# Altium project probe.PrjPcb
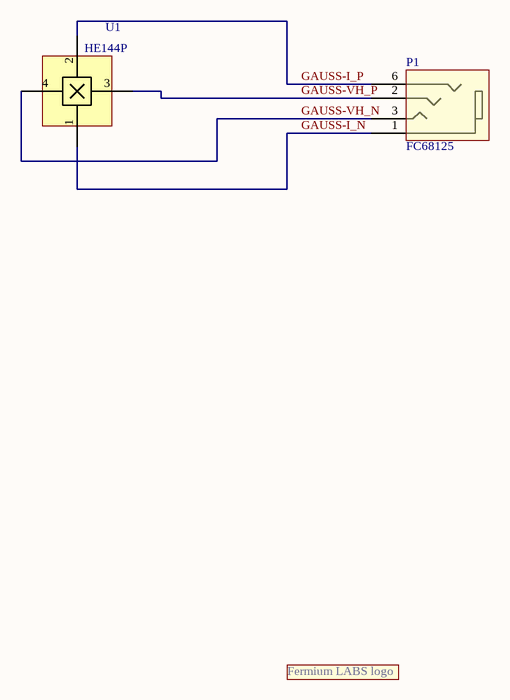
[diagram p0: probe.SchDoc]
1 sheet, 3 parts. Net scope: global (net labels, ports and power ports of the same name join across sheets).
Board file: probe.PcbDoc

## Sheet probe.SchDoc: Hall / Probe board
size A4; DocumentNumber: 1; SheetNumber: 1; SheetTotal: 1

### Parts
logo  fermiumlabs-logo  [frm-med]  (value not drawn)  (no BOM)
P1  (no value)  [FC68125]
U1  (no value)  [HE144P-buried]

### Nets
GAUSS-I_N: P1.1 U1.1
GAUSS-I_P: P1.6 U1.2
GAUSS-VH_N: P1.3 U1.4
GAUSS-VH_P: P1.2 U1.3

### Notes on the sheet
- Title
- Size:
- Date:
- A4
- Number:
- Time:
- Revision:
- Sheet
- of
- Fermium LABS srl
- Via Monselice 15a
- 35142 Padova PD
- Italy
- File:
- (in symbol fermiumlabs-logo) Fermium LABS logo

### Library data of the parts
P1 = FC68125: Manufacturer: CLIFF; Unit: pcs; SuppliedAmount: 0; MinAmount: 2; Multiples: 1; Connector: socket; Connector type: Jack 3,5mm; Number of ways: 4; Electrical mounting: THT; Pads: 5 THT; Supplier 1: TME; Supplier Part Number 1: FC68125; Manufacturer Part Number: FC68125; Category: Jack connectors; Stock 1: 1312; Pricing 1: 2=0.41, 20=0.37, 100=0.33, 500=0.28 (USD); Weight: 0.942; Width: 7.1mm; Height: 6mm; Depth: 15.1mm; Price Type: NET; ComponentLink1URL: http://static.tme.eu/products_pics/9/3/a/93a060f269bb569398921100f84c519a/360179.jpg; ComponentLink1Description: http://static.tme.eu/products_pics/9/3/a/93a060f269bb569398921100f84c519a/360179.jpg
U1 = he144p: Manufacturer: Asensor; Pads: 4 THT; Supplier 1: Asensor; Manufacturer Part Number: HE144P; Supplier Part Number 1: HE144P